# Altium project McGill_Robotics_Rover_BLDCmotorESCboard.PrjPcb
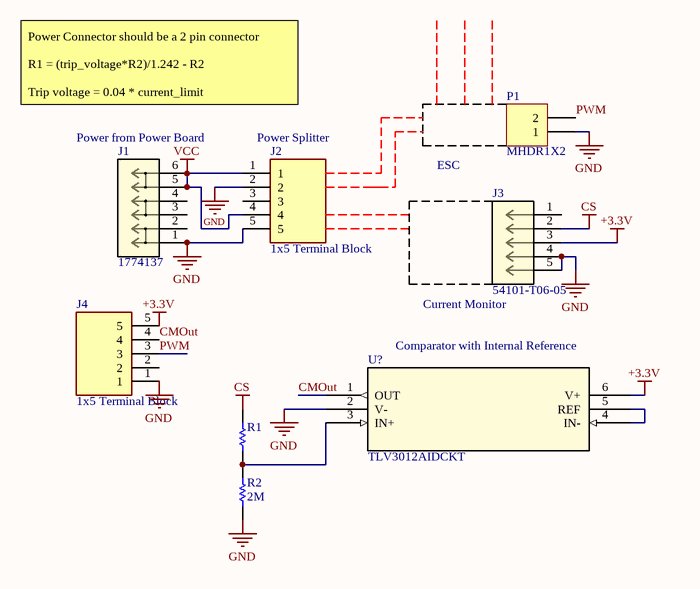
[diagram p0: BLDC Motor ESC.SchDoc]
1 sheet, 8 parts. Net scope: global (net labels, ports and power ports of the same name join across sheets).
Board file: BLDC Motor ESC.PcbDoc

## Sheet BLDC Motor ESC.SchDoc
size A4; SheetNumber: 1; SheetTotal: 1

### Parts
J1  1774137  [CONN_1774137]
J2  1x5 Terminal Block  [CUI_TB005-762-05BE]
J3  54101-T06-05  [54101-T06-05_AMP]
J4  1x5 Terminal Block  [CUI_TB005-762-05BE]
P1  MHDR1X2  [MHDR1X2]
R1  (no value)  [RES_0603]
R2  2M  [RES_0603]
U?  TLV3012AIDCKT  [DCK6]

### Nets
+3.3V: J3.3 J4.5 U?.6(V+)
CS: J3.2 R1.2
GND: J1.1 J2.2 J2.5 J3.4 J3.5 J4.1 P1.1 R2.1 U?.2(V-)
VCC: J1.5 J1.6 J2.1 J2.4
CMOut: J4.4 U?.1(OUT)
PWM: J4.3 P1.2
NetR1_1: R1.1 R2.2 U?.3(IN+)
NetU?_4: U?.4(IN-) U?.5(REF)

Not connected (* = marked no-connect by the designer): J1 2 3 4; J2 3; J3 1; J4 2

### Notes on the sheet
- Power Connector should be a 2 pin connector
  R1 = (trip_voltage*R2)/1.242 - R2
  Trip voltage = 0.04 * current_limit
- (near J1) Power from Power Board
- (near J2) Power Splitter
- ESC
- (near U?) Comparator with Internal Reference
- (near J3) Current Monitor

### Library data of the parts
J1 = 1774137: No Description Available; Mfr_Name: Phoenix Contact; Copyright: Copyright (C) 2022 Ultra Librarian. All rights reserved.; Manufacturer_Part_Number: 1774137; Digi-Key_Part_Number_1: 277-6019-ND; RefDes: RefDes; Type: DEV
J2 J4 = TB005-762-05BE: 2~24 Poles, Screw Type, Horizontal, 7.62 Pitch, 26~10 (AWG), Terminal Block Connector; MF: CUI Devices; Value: *; CUI_purchase_URL: https://www.cuidevices.com/product/interconnect/connectors/terminal-blocks/tb005-762-series?utm_source=snapeda.com&utm_medium=referral&utm_campaign=snapedaBOM; SnapEDA_Link: https://www.snapeda.com/parts/TB005-762-05BE/CUI%20Devices/view-part/3590997/?ref=snap; Availability: Unavailable; MP: TB005-762-05BE; Package: None; Price: None
J3 = 54101-T06-05: No Description Available; Mfr_Name: Amphenol ICC; Copyright: Copyright (C) 2022 Ultra Librarian. All rights reserved.; Manufacturer_Part_Number: 54101-T06-05; Digi-Key_Part_Number_1: 54101-T06-05-ND; Digi-Key_Part_Number_2: 609-54101-T06-05-ND; RefDes: RefDes; Type: DEV
P1 = MHDR1X2: Header, 2-Pin; LatestRevisionDate: 17-Jul-2002; LatestRevisionNote: Re-released for DXP Platform.; Publisher: Altium Limited
R1 R2 = 249_1%_0603: RES SMD 249 OHM 1% 1/10W 0603; Manufacturer: Panasonic Electronic Components; Manufacturer Part Number: ERJ-3EKF2490V; Resistance (Ohms): 249; Power (Watts): 0.1W, 1/10W; Temperature Coefficient: ±100ppm/°C; Supplier 1: Digi-Key; Supplier Part Number 1: P249HCT-ND; RoHS: RoHS Compliant; Category: Resistors; Stock 1: 174505; Pricing 1: 1=0.14, 50=0.0206, 100=0.0157, 250=0.01164, 500=0.0086, 1000=0.00574, 2500=0.00484 (CAD); Packaging: Cut Tape (CT); Tolerance: ±1%; Composition: Thick Film; Features: Automotive AEC-Q200; Operating Temperature: -55°C ~ 155°C; Package / Case: 0603 (1608 Metric); Supplier Device Package: 0603; Size / Dimension: 0.063" L x 0.031" W (1.60mm x 0.80mm); Height: 0.022" (0.55mm); Number of Terminations: 2; ComponentLink1URL: http://industrial.panasonic.com/www-cgi/jvcr13pz.cgi?E+PZ+3+AOA0002+ERJ3EKF2490V+7+WW; ComponentLink1Description: http://industrial.panasonic.com/www-cgi/jvcr13pz.cgi?E+PZ+3+AOA0002+ERJ3EKF2490V+7+WW
U? = TLV3012AIDCKT: No Description Available; Mfr_Name: Texas Instruments; Copyright: Copyright (C) 2022 Ultra Librarian. All rights reserved.; Manufacturer_Part_Number: TLV3012AIDCKT; Digi-Key_Part_Number_1: 296-17118-1-ND; Digi-Key_Part_Number_2: 296-17118-2-ND; Digi-Key_Part_Number_3: 296-17118-6-ND; Digi-Key_Part_Number_4: 2156-TLV3012AIDCKT-ND; RefDes: RefDes; Type: DEV